# Altium schematic sheet Channel.SchDoc
size A; SheetNumber: 1; SheetTotal: 4
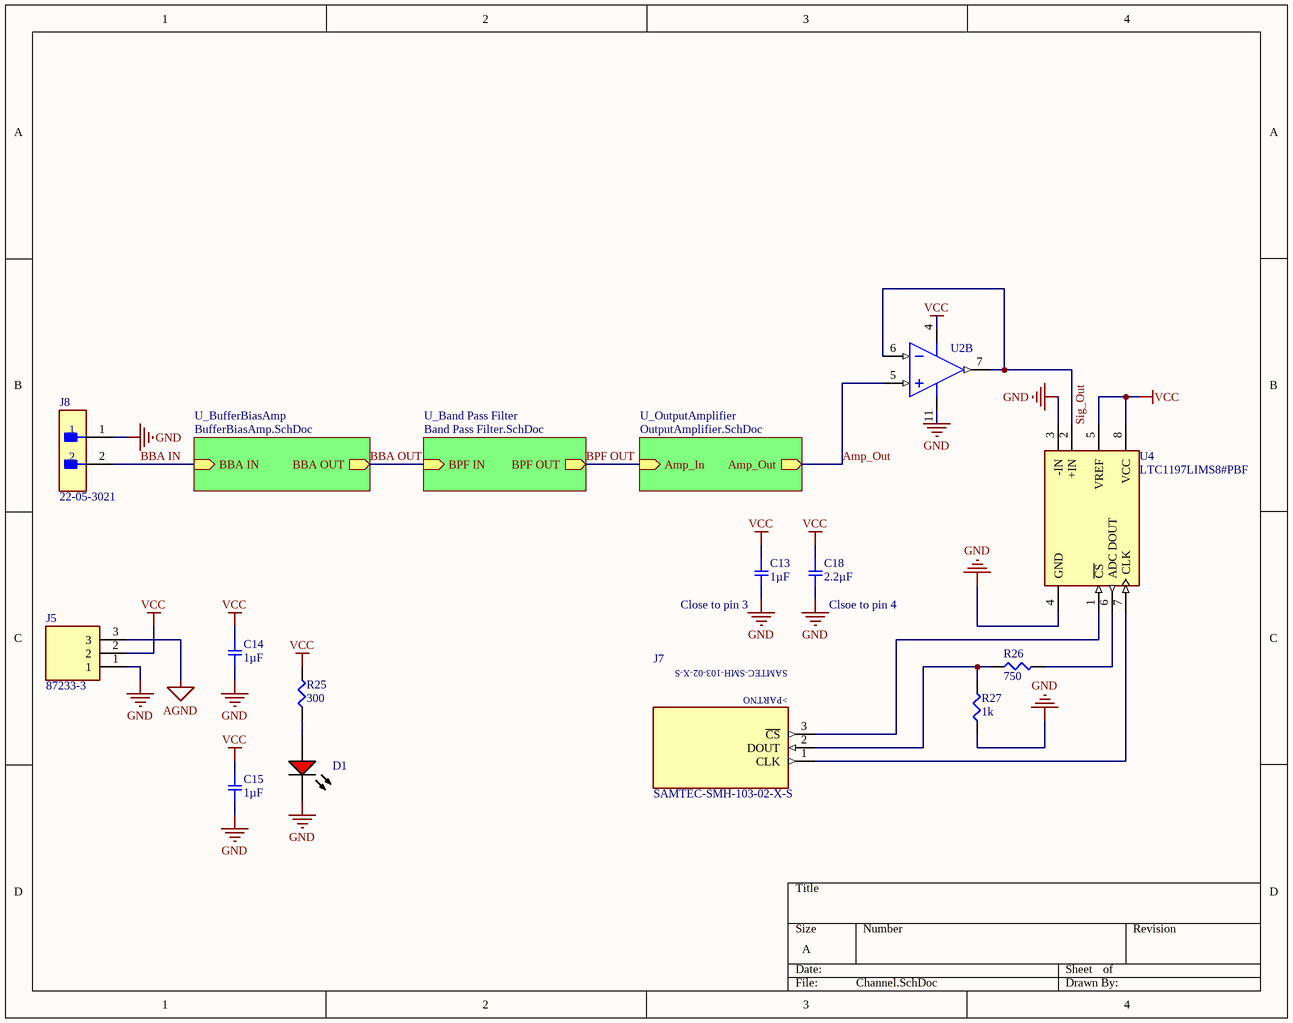
[diagram p0: Channel.SchDoc]

## Parts
C13  1µF  [SMD-0603C]
C14  1µF  [SMD-0603C]
C15  1µF  [SMD-0603C]
C18  2.2µF  [SMD-0603C]
D1  TLMS1100-GS08  [VISH-TLMX1100_V]  (value not drawn)
J5  87233-3  [TE_87233-3]
J7  SAMTEC-SMH-103-02-X-S  [SAMTEC-SMH-103-02-X-S]
J8  22-05-3021  [FP-22-05-3021-MFG]
R25  300  [SMD-0603-RES]
R26  750  [SMD-0603-RES]
R27  1k  [SMD-0603-RES]
U2  OPA1604AIPWR  [PW0014A_N]  (value not drawn)  (part B of 4)
U4  LTC1197LIMS8#PBF  [FP-MS8-8-05-08-1660-IPC_A]

## Sub-sheets
U_Band Pass Filter = Band Pass Filter.SchDoc: BPF IN (in), BPF OUT (out)
U_BufferBiasAmp = BufferBiasAmp.SchDoc: BBA IN (in), BBA OUT (out)
U_OutputAmplifier = OutputAmplifier.SchDoc: Amp_In (in), Amp_Out (out)

## Nets
AGND: J5.3
GND: C13.2 C14.1 C15.1 C18.2 D1.2(K) J5.1 J8.1 R27.1 U2.11(V-) U4.3(-IN) U4.4(GND)
VCC: C13.1 C14.2 C15.2 C18.1 J5.2 R25.2 U2.4(V+) U4.5(VREF) U4.8(VCC)
Amp_Out: U2.5(IN_B+) ; sheet U_OutputAmplifier/Amp_Out
BBA IN: J8.2 ; sheet U_BufferBiasAmp/BBA IN
BBA OUT: sheet U_Band Pass Filter/BPF IN, sheet U_BufferBiasAmp/BBA OUT
BPF OUT: sheet U_OutputAmplifier/Amp_In, sheet U_Band Pass Filter/BPF OUT
Sig_Out: U2.6(IN_B-) U2.7(OUT_B) U4.2(+IN)
NetD1_1: D1.1(A) R25.1
NetJ7_1: J7.1(CLK) U4.7(CLK)
NetJ7_2: J7.2(DOUT) R26.1 R27.2
NetJ7_3: J7.3(~{CS}) U4.1(~{CS})
NetR26_2: R26.2 U4.6(ADC_DOUT)

## Notes on the sheet
- (near C13) Close to pin 3
- (near C18) Clsoe to pin 4
- (in symbol SAMTEC-SMH-103-02-X-S) >PARTNO

## Library data of the parts
C13 = GRM185C80J105KE26D: CAP CER 1UF 6.3V X6S 0603; Manufacturer: Murata Electronics North America; Factory Stock: 0; Unit Price (USD): 0.2; Minimum Quantity: 1; Tolerance: ±10%; Datasheets: http://www.murata.com/~/media/webrenewal/support/library/catalog/products/capacitor/mlcc/c02e.pdf; Image: //media.digikey.com/Renders/Murata%20Renders/ZRB-SERIES-0402.jpg; Digi-Key Part Number: 490-8271-1-ND; Part Number: GRM185C80J105KE26D; Quantity Available: 11240; @ qty: 0; Packaging: Cut Tape (CT); Series: GRM; Part Status: Active; Value: 1µF; Voltage: 6.3V; Temperature Coefficient: X6S; Operating Temperature: -55°C ~ 105°C; Features: -; Ratings: -; Applications: General Purpose; Mounting Type: Surface Mount, MLCC; Package / Case: 0603 (1608 Metric); Size / Dimension: 0.063" L x 0.031" W (1.60mm x 0.80mm); Height - Seated (Max): -; Thickness (Max): 0.020" (0.50mm); Lead Spacing: -; Lead Style: -
C14 C15 = GCM188R71C105KA64D: CAP CER 1UF 16V X7R 0603; Manufacturer: Samsung Electro-Mechanics; Manufacturer Part Number: CL10A105KA8NNNC; Value: 1µF; Operating Temperature: -55°C ~ 125°C; Package / Case: 0603 (1608 Metric); Datasheet Link: https://www.digikey.com/en/products/detail/samsung-electro-mechanics/CL10A105KA8NNNC/3886760
C18 = GCM188R70J225KE22D: CAP CER 2.2UF 6.3V X7R 0603; Manufacturer: Murata Electronics North America; Factory Stock: 0; Unit Price (USD): 0.23; Minimum Quantity: 1; Tolerance: ±10%; Datasheets: http://www.murata.com/~/media/webrenewal/support/library/catalog/products/capacitor/mlcc/c03e.ashx; Image: //media.digikey.com/Renders/Murata%20Renders/0603%28GCM188%29.jpg; Digi-Key Part Number: 490-5316-1-ND; Part Number: GCM188R70J225KE22D; Quantity Available: 20695; @ qty: 0; Packaging: Cut Tape (CT); Series: GCM; Part Status: Active; Value: 2.2µF; Voltage: 6.3V; Temperature Coefficient: X7R; Operating Temperature: -55°C ~ 125°C; Features: -; Ratings: AEC-Q200; Applications: Automotive; Mounting Type: Surface Mount, MLCC; Package / Case: 0603 (1608 Metric); Size / Dimension: 0.063" L x 0.031" W (1.60mm x 0.80mm); Height - Seated (Max): -; Thickness (Max): 0.035" (0.90mm); Lead Spacing: -; Lead Style: -
D1 = CMP-1666-00027-1: LED, RED, 2.1 V, -40 to 100 degC, 2-Pin SMD (0603), RoHS, Tape and Reel; Manufacturer: Wurth Elektronics; Manufacturer Part Number: 150080SS75000; Value: 1.9V; Datasheet Link: https://www.mouser.com/ProductDetail/Wurth-Elektronik/150080SS75000?qs=LlUlMxKIyB2zzpiaOzrUdw%3D%3D&mgh=1&gclid=Cj0KCQjwm6KUBhC3ARIsACIwxBhChbj4MsdASq_HKZ9IIHp_SBsI6cWeNQVHWnPWPX4ZaUjtoXFUdFUaAm30EALw_wcB; Operating Temperature: -40to85degC; Package / Case: 0805 (2012 Metric); RoHS: Pb-Free
J5 = 87233-3: MF: {'manufacturer': u'TE Connectivity'}; Value: *; Price: None; Package: None; Availability: Unavailable; MP: 87233-3
J7 = SAMTEC-SMH-103-02-X-S: MF: {'manufacturer': u'Samtec'}; Value: *; Package: None; MP: SAMTEC-SMH-103-02-X-S; Availability: Unavailable; Price: None
J8 = CMP-04776-000166-1: CONN HEADER R/A 2POS 2.54MM; Glow Wire Compliant: Non-compliant; Max Current Rating: 4A; Number of Positions: 2; Contact Resistance: 10mR; Max Voltage Rating (AC): 250V; Gender: Male; Approvals: UL; Contact Material: Brass; Halogen Free: Low Halogen; Depth: 12.83mm; Color: White; Mount: Through Hole; Housing Color: White; Package Quantity: 3000; Series: KK® 7478; Packaging: Bulk; Length: 5.08mm; Fastening Type: Friction; Contact Plating: Tin; Flammability Rating: UL94 V-0; Housing Material: Nylon; Current Rating: 4A; Max Operating Temperature: 75°C; Height: 6.35mm; Lead Free: Lead Free; Pitch: 2.54mm; Termination: Solder; Min Operating Temperature: 0°C; Voltage Rating: 250V; Radiation Hardening: No; Number of Contacts: 2; Contact Mating Length: 0.264inch; Orientation: Right Angle; Contact Type: Male Pin; Number of Rows: 1; Number of Circuits: 2
R25 = ERJ-3EKF3000V: RES SMD 300 OHM 1% 1/10W 0603; Manufacturer: Panasonic Electronic Components; Value: 300; Operating Temperature: -55°C ~ 155°C; Package / Case: 0603 (1608 Metric); Datasheet Link: https://www.digikey.com/en/products/detail/panasonic-electronic-components/ERJ-3EKF3000V/1746363; Manufacturer Part Number: ERJ-3EKF3000V
R26 = ERJ-3EKF7500V: RES SMD 750 OHM 1% 1/10W 0603; Manufacturer: Panasonic Electronic Components; Factory Stock: 0; Unit Price (USD): 0.00379; @ qty: 1500; Minimum Quantity: 1; Power (Watts): 0.1W, 1/10W; Temperature Coefficient: ±100ppm/°C; Part Number: ERJ-3EKF7500V; Datasheets: http://industrial.panasonic.com/www-cgi/jvcr13pz.cgi?E+PZ+3+AOA0002+ERJ3EKF7500V+7+WW; Image: //media.digikey.com/Photos/Panasonic%20Photos/MFG_ERJ-P6W%20Series.jpg; Digi-Key Part Number: P750HCT-ND; Quantity Available: 102837; Packaging: Cut Tape (CT); Series: ERJ; Part Status: Active; Value: 750; Tolerance: ±1%; Composition: Thick Film; Features: Automotive AEC-Q200; Operating Temperature: -55°C ~ 155°C; Package / Case: 0603 (1608 Metric); Supplier Device Package: 0603; Size / Dimension: 0.063" L x 0.031" W (1.60mm x 0.80mm); Height - Seated (Max): 0.022" (0.55mm); Number of Terminations: 2; Failure Rate: -
R27 = ERJ-3EKF1001V: RES SMD 1K OHM 1% 1/10W 0603; Manufacturer: Panasonic Electronic Components; Factory Stock: 0; Unit Price (USD): 0.00379; @ qty: 1500; Minimum Quantity: 1; Power (Watts): 0.1W, 1/10W; Temperature Coefficient: ±100ppm/°C; Part Number: ERJ-3EKF1001V; Datasheets: http://industrial.panasonic.com/www-cgi/jvcr13pz.cgi?E+PZ+3+AOA0002+ERJ3EKF1001V+7+WW; Image: //media.digikey.com/Photos/Panasonic%20Photos/MFG_ERJ-P6W%20Series.jpg; Digi-Key Part Number: P1.00KHCT-ND; Quantity Available: 5218845; Packaging: Cut Tape (CT); Series: ERJ; Part Status: Active; Value: 1k; Tolerance: ±1%; Composition: Thick Film; Features: Automotive AEC-Q200; Operating Temperature: -55°C ~ 155°C; Package / Case: 0603 (1608 Metric); Supplier Device Package: 0603; Size / Dimension: 0.063" L x 0.031" W (1.60mm x 0.80mm); Height - Seated (Max): 0.022" (0.55mm); Number of Terminations: 2; Failure Rate: -
U2 = CMP-0272-01731-3: Sound Plus High-Performance, Bipolar-Input Audio Operational Amplifier, 4.5 to 36 V, -40 to 85 degC, 14-pin SOP (PW14), Green (RoHS & no Sb/Br); Manufacturer: Texas Instruments; Datasheet Link: https://www.digikey.com/en/products/detail/texas-instruments/OPA1604AIPWR/2793768; Manufacturer Part Number: OPA1604AIPWR; Operating Temperature: -40°C ~ 85°C; Package / Case: 14-TSSOP
U4 = CMP-09081-000582-1: IC ADC 10BIT SAR 8MSOP; Number of Converters: 1; Polarity: Unipolar; Max Supply Voltage: 4V; Number of Bits: 10; Max Power Dissipation: 25mW; Min Supply Voltage: 2.7V; Sampling Rate: 250000S/s; Integral Nonlinearity (INL): 1LSB; Supply Type: Single; Resolution: 10b; Power Dissipation: 500mW; Interface: SPI; Operating Supply Voltage: 3V; Package Quantity: 50; Min Operating Temperature: -40°C; Case/Package: MSOP; Lead Free: Lead Free; Max Operating Temperature: 85°C; Number of Elements: 1; RoHS Compliant: Yes; Mount: Surface Mount; Number of Pins: 8; Packaging: Rail/Tube